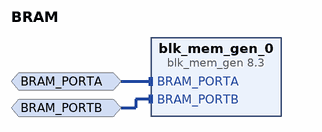
[diagram p0: block diagram of the top level]
# Vivado block design BRAM, Vivado 2016.2
create_bd_design BRAM

create_bd_intf_port -mode Slave -vlnv xilinx.com:interface:bram_rtl:1.0 BRAM_PORTA
create_bd_intf_port -mode Slave -vlnv xilinx.com:interface:bram_rtl:1.0 BRAM_PORTB

create_bd_cell -type ip -vlnv xilinx.com:ip:blk_mem_gen:8.3 blk_mem_gen_0
set_property -dict [list \
  CONFIG.Memory_Type True_Dual_Port_RAM \
  CONFIG.Enable_32bit_Address false \
  CONFIG.Use_Byte_Write_Enable true \
  CONFIG.Byte_Size 8 \
  CONFIG.Assume_Synchronous_Clk true \
  CONFIG.Write_Width_A 16 \
  CONFIG.Write_Depth_A 65536 \
  CONFIG.Read_Width_A 16 \
  CONFIG.Operating_Mode_A READ_FIRST \
  CONFIG.Enable_A Always_Enabled \
  CONFIG.Write_Width_B 16 \
  CONFIG.Read_Width_B 16 \
  CONFIG.Operating_Mode_B READ_FIRST \
  CONFIG.Enable_B Always_Enabled \
  CONFIG.Register_PortA_Output_of_Memory_Primitives false \
  CONFIG.Register_PortB_Output_of_Memory_Primitives false \
  CONFIG.Fill_Remaining_Memory_Locations false \
  CONFIG.Use_RSTA_Pin false \
  CONFIG.Use_RSTB_Pin false \
  CONFIG.Additional_Inputs_for_Power_Estimation false \
  CONFIG.Port_A_Write_Rate 50 \
  CONFIG.Port_B_Clock 100 \
  CONFIG.Port_B_Write_Rate 50 \
  CONFIG.Port_B_Enable_Rate 100 \
  CONFIG.Disable_Collision_Warnings false \
  CONFIG.use_bram_block Stand_Alone \
  CONFIG.EN_SAFETY_CKT false \
] [get_bd_cells blk_mem_gen_0]

# ---- connections ----

connect_bd_intf_net [get_bd_intf_ports BRAM_PORTA] [get_bd_intf_pins blk_mem_gen_0/BRAM_PORTA]
connect_bd_intf_net [get_bd_intf_ports BRAM_PORTB] [get_bd_intf_pins blk_mem_gen_0/BRAM_PORTB]

validate_bd_design
save_bd_design
